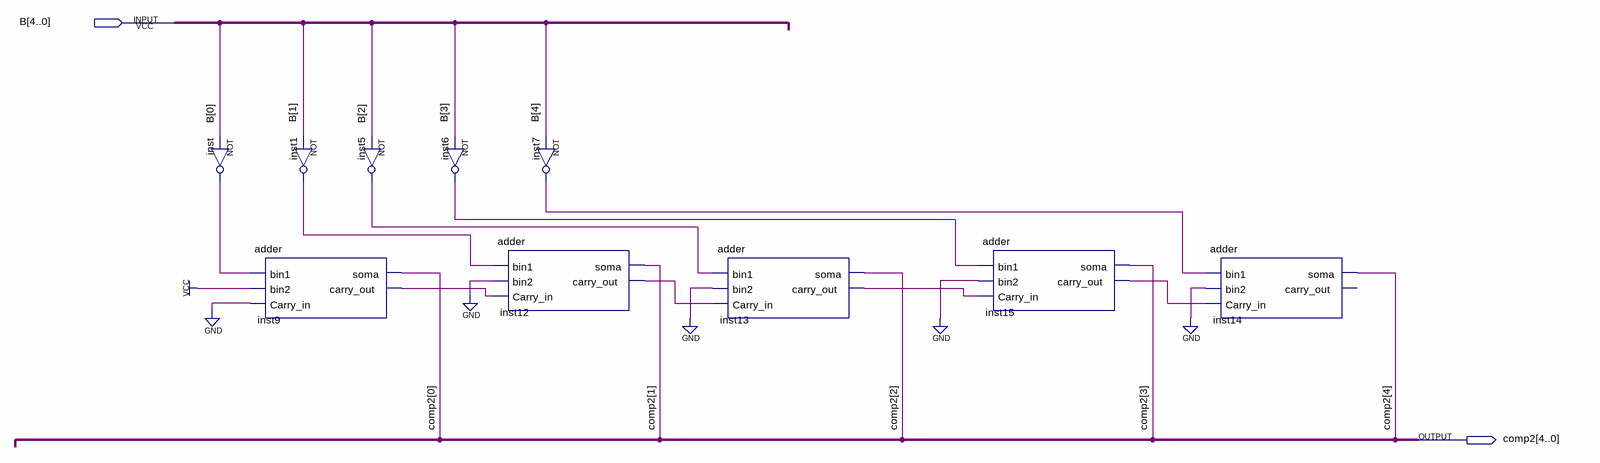
[diagram p0: schematic sheet]
// Quartus schematic complemento2.bdf as structural Verilog: 10 symbols, 2 pins
module complemento2 (
  input  [4:0] B,
  output [4:0] comp2
);

  wire inst1_out, inst5_out, inst6_out, inst7_out, inst9_carry_out, inst12_carry_out, inst13_carry_out,
       inst15_carry_out, inst_out;

  not inst (inst_out, B[0]);
  adder inst9 (.bin1(inst_out), .bin2(1'b1), .Carry_in(1'b0), .soma(comp2[0]), .carry_out(inst9_carry_out));
  not inst1 (inst1_out, B[1]);
  not inst5 (inst5_out, B[2]);
  not inst6 (inst6_out, B[3]);
  adder inst12 (
    .bin1(inst1_out), .bin2(1'b0), .Carry_in(inst9_carry_out), .soma(comp2[1]), .carry_out(inst12_carry_out));
  not inst7 (inst7_out, B[4]);
  adder inst13 (
    .bin1(inst5_out), .bin2(1'b0), .Carry_in(inst12_carry_out), .soma(comp2[2]), .carry_out(inst13_carry_out));
  adder inst15 (
    .bin1(inst6_out), .bin2(1'b0), .Carry_in(inst13_carry_out), .soma(comp2[3]), .carry_out(inst15_carry_out));
  adder inst14 (.bin1(inst7_out), .bin2(1'b0), .Carry_in(inst15_carry_out), .soma(comp2[4]));  // open: carry_out
endmodule
